# Altium schematic sheet power.SchDoc
size B; SheetNumber: 3; SheetTotal: 6
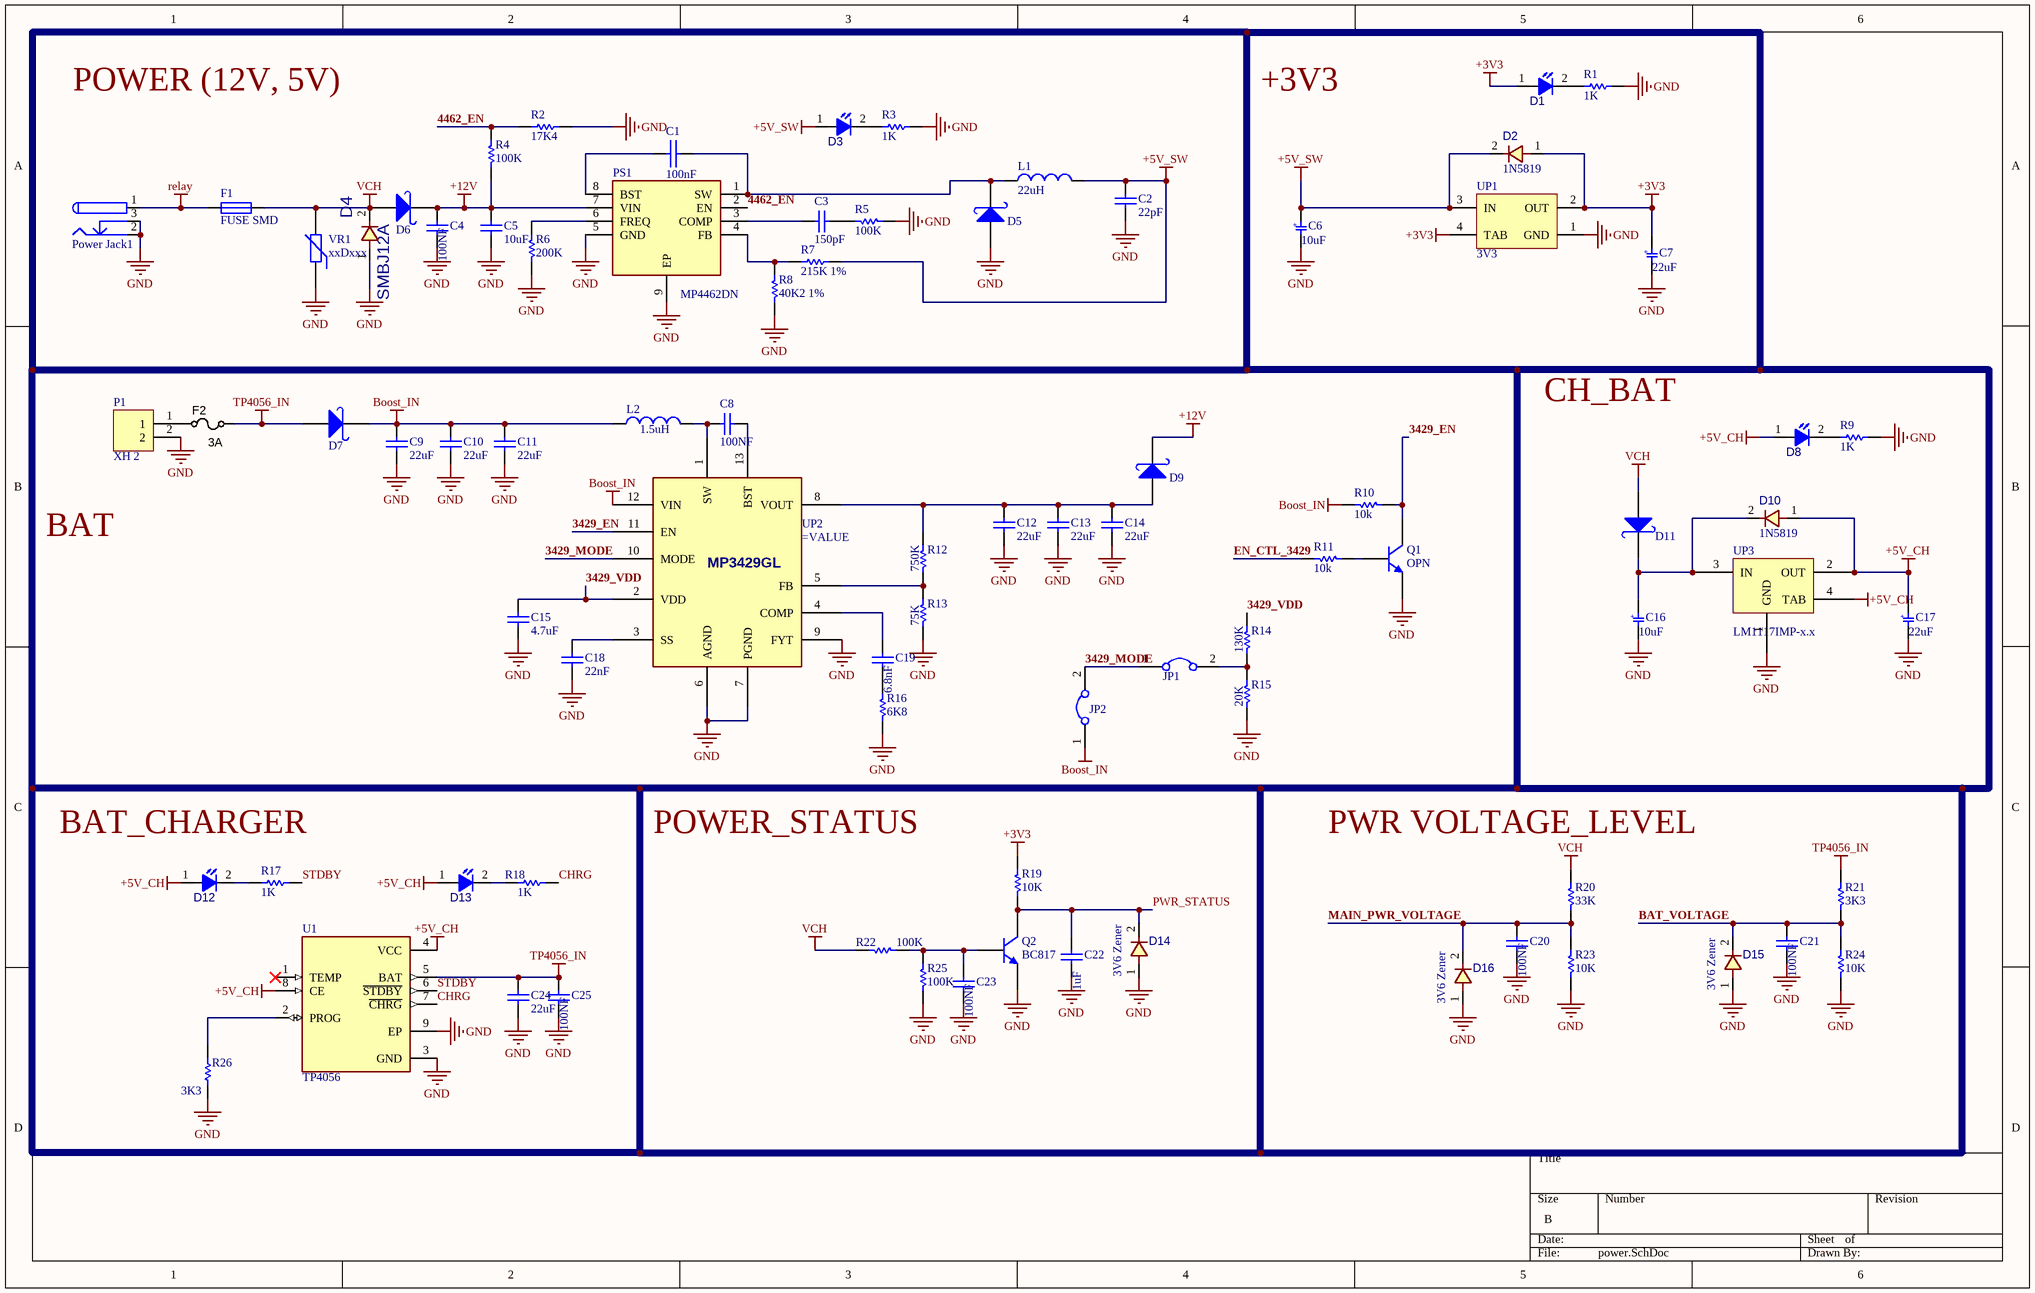
[diagram p0: power.SchDoc]

## Parts
C1  100nF  [Cap-0805]
C2  22pF  [CAPC4817X12N]
C3  150pF  [CAPC3413X12N]
C4  100NF  [CAP0603]
C5  10uF  [CAPC4817X12N]
C6  10uF  [Cap_A]
C7  22uF  [Cap_A]
C8  100NF  [CAP0603]
C9  22uF  [Cap1206_(3216X15L)]
C10  22uF  [Cap1206_(3216X15L)]
C11  22uF  [Cap1206_(3216X15L)]
C12  22uF  [Cap1206_(3216X15L)]
C13  22uF  [Cap1206_(3216X15L)]
C14  22uF  [Cap1206_(3216X15L)]
C15  4.7uF  [CAPC3413X12N]
C16  10uF  [Cap_A]
C17  22uF  [Cap_A]
C18  22nF  [CAPC3413X12N]
C19  6.8nF  [CAP0603]
C20  100NF  [CAP0603]
C21  100NF  [CAP0603]
C22  1uF  [CAP0603]
C23  100NF  [CAP0603]
C24  22uF  [Cap1206_(3216X15L)]
C25  100NF  [CAP0603]
D1  RED LED  [LED SMD 0805 (Red)]  (value not drawn)
D2  value 1N5819  [D_SMA]  (hidden comment: 1n5819 SMD SS31)
D3  RED LED  [LED SMD 0805 (Red)]  (value not drawn)
D4  value SMBJ12A  [D_SMB]  (hidden comment: SMBJ12A-TR SMD)
D5  1n5822  [DIOM7568X24N]  (value not drawn)
D6  1n5822  [DIOM7568X24N]  (value not drawn)
D7  1n5822  [DIOM7568X24N]  (value not drawn)
D8  RED LED  [LED SMD 0805 (Red)]  (value not drawn)
D9  1n5822  [DIOM7568X24N]  (value not drawn)
D10  value 1N5819  [D_SMA]  (hidden comment: 1n5819 SMD SS31)
D11  1n5822  [DIOM7568X24N]  (value not drawn)
D12  RED LED  [LED SMD 0805 (Red)]  (value not drawn)
D13  GREEN LED  [LED SMD 0805 (Green)]  (value not drawn)
D14  value 3V6 Zener  [D_SOD80]  (hidden comment: 5Z1)
D15  value 3V6 Zener  [D_SOD80]  (hidden comment: 5Z1)
D16  value 3V6 Zener  [D_SOD80]  (hidden comment: 5Z1)
F1  FUSE SMD  [8-1206]
F2  3A  [RESC1608X55N]
JP1  Jumper  [Jumper Small - 2.54 - GRAY]  (value not drawn)
JP2  Jumper  [Jumper Small - 2.54 - GRAY]  (value not drawn)
L1  22uH  [INDUCTOR_SMD_3A]
L2  1.5uH  [INDUCTOR_SMD_3A]
P1  XH 2  [XH 2 PIN ( White )]
Power_Jack1  Power Jack.  [Power Jack.]  (value not drawn)
PS1  MP4462DN  [SOIC127P600X170-9N]
Q1  OPN  [SOT23_N]
Q2  BC817  [SOT23_N]
R1  1K  [R0603]
R2  17K4  [SMD-0805-RES]
R3  1K  [R0603]
R4  100K  [R0603]
R5  100K  [R0603]
R6  200K  [R0603]
R7  215K 1%  [SMD-0805-RES]
R8  value 40K2 1%  [R0603]  (hidden comment: 40K2)
R9  1K  [R0603]
R10  10k  [R0603]
R11  10k  [R0603]
R12  750K  [R0603]
R13  75K  [R0603]
R14  130K  [R0603]
R15  20K  [R0603]
R16  value 6K8  [R0603]  (hidden comment: 100K)
R17  1K  [R0603]
R18  1K  [R0603]
R19  10K  [R0603]
R20  33K  [R0603]
R21  3K3  [R0603]
R22  100K  [R0603]
R23  10K  [R0603]
R24  10K  [R0603]
R25  100K  [R0603]
R26  3K3  [R0603]
U1  TP4056  [SOP127P600X175-9N]
UP1  3V3  [SOT223]
UP2  (no value)  [GFN-13 (3mm*4mm)]
UP3  LM1117IMP-x.x  [SOT223_4]
VR1  xxDxxx  [05D XXX]

## Nets
+3V3: C7.2 D1.1(ANODE) D2.1 R19.1 UP1.2(OUT) UP1.4(TAB)
+5V_CH: C17.2 D8.1(ANODE) D10.1 D12.1(ANODE) D13.1(ANODE) U1.4(VCC) U1.8(CE) UP3.2(OUT) UP3.4(TAB)
+5V_SW: C2.2 C6.2 D2.2 D3.1(ANODE) L1.2 R7.2 UP1.3(IN)
+12V: C4.2 C5.2 D6.2(K) D9.2(K) PS1.7(VIN) R4.1
Boost_IN: C9.2 C10.2 C11.2 D7.2(K) JP2.1 L2.1 R10.1 UP2.12(VIN)
GND: C2.1 C4.1 C5.1 C6.1 C7.1 C9.1 C10.1 C11.1 C12.1 C13.1 C14.1 C15.1 C16.1 C17.1 C18.1 C20.1 C21.1 C22.1 C23.1 C24.1 C25.1 D4.1 D5.1(A) D14.1 D15.1 D16.1 P1.2 Power_Jack1.2 Power_Jack1.3 PS1.5(GND) PS1.9(EP) Q1.2(E) Q2.2(E) R1.2 R2.2 R3.2 R5.2 R6.2 R8.1 R9.2 R13.1 R15.1 R16.2 R23.2 R24.2 R25.2 R26.1 U1.3(GND) U1.9(EP) UP1.1(GND) UP2.6(AGND) UP2.7(PGND) UP2.9(FYT) UP3.1(GND) VR1.1
relay: F1.1 Power_Jack1.1
TP4056_IN: C24.2 C25.2 D7.1(A) F2.2 R21.1 U1.5(BAT)
VCH: D4.2 D6.1(A) D11.1(A) F1.2 R20.1 R22.2 VR1.2
3429_EN: Q1.3(C) R10.2 UP2.11(EN)
3429_MODE: JP1.1 JP2.2 UP2.10(MODE)
3429_VDD: C15.2 R14.2 UP2.2(VDD)
4462_EN: PS1.2(EN) R2.1 R4.2
BAT_VOLTAGE: C21.2 D15.2 R21.2 R24.1
CHRG: R18.2 U1.7(~{CHRG})
EN_CTL_3429: R11.2
MAIN_PWR_VOLTAGE: C20.2 D16.2 R20.2 R23.1
PWR_STATUS: C22.2 D14.2 Q2.3(C) R19.2
STDBY: R17.2 U1.6(~{STDBY})
NetC1_1: C1.1 PS1.8(BST)
NetC1_2: C1.2 D5.2(K) L1.1 PS1.1(SW)
NetC3_1: C3.1 PS1.3(COMP)
NetC3_2: C3.2 R5.1
NetC8_1: C8.1 L2.2 UP2.1(SW)
NetC8_2: C8.2 UP2.13(BST)
NetC12_2: C12.2 C13.2 C14.2 D9.1(A) R12.2 UP2.8(VOUT)
NetC16_2: C16.2 D10.2 D11.2(K) UP3.3(IN)
NetC18_2: C18.2 UP2.3(SS)
NetC19_1: C19.1 R16.1
NetC19_2: C19.2 UP2.4(COMP)
NetC23_2: C23.2 Q2.1(B) R22.1 R25.1
NetD1_2: D1.2(CATHODE) R1.1
NetD3_2: D3.2(CATHODE) R3.1
NetD8_2: D8.2(CATHODE) R9.1
NetD12_2: D12.2(CATHODE) R17.1
NetD13_2: D13.2(CATHODE) R18.1
NetF2_1: F2.1 P1.1
NetJP1_2: JP1.2 R14.1 R15.2
NetPS1_4: PS1.4(FB) R7.1 R8.2
NetPS1_6: PS1.6(FREQ) R6.1
NetQ1_1: Q1.1(B) R11.1
NetR12_1: R12.1 R13.2 UP2.5(FB)
NetR26_2: R26.2 U1.2(PROG)

Not connected (* = marked no-connect by the designer): U1 1(TEMP)*

## Notes on the sheet
- POWER (12V, 5V)
- +3V3
- CH_BAT
- BAT
- BAT_CHARGER
- POWER_STATUS
- (near R20) PWR VOLTAGE_LEVEL
- (in symbol Capacitor Tantalum SMD) +
- (in symbol MP3429) MP3429GL

## Library data of the parts
C1 = Capacitor.: Capacitor; LatestRevisionDate: 17-Jul-2002; LatestRevisionNote: Re-released for DXP Platform.; Publisher: Altium Limited; Value: 100nF
C2 C5 = CAP SMD 1206: CAP 1206; Designer: Abbas Basereh; Desc.: CAP SMD 1206; Data: 16-12-2016
C3 C15 C18 = CAP SMD 0805: CAP 0805; Designer: Abbas Basereh; Desc.: CAP SMD 0805; Data: 16-12-2016
C4 C8 C20 C21 C23 C25 = CAP SMD PACKAGE: TOTAL CAPACITOR SMD PACK; Designer: Abbas Basereh; Desc.: CAP SMD TOTAL PACKAGES; Data: 2017-3-10; VALUE: 100nF
C6 C7 C16 C17 = Capacitor Tantalum SMD: DatasheetVersion: 2021; ComponentLink1Description: Website Smart World; ComponentLink1URL: https://www.smartw.ir/; ComponentLink2Description: Telegram; ComponentLink2URL: https://t.me/altium_smartw; ComponentLink3Description: Instagram; ComponentLink3URL: https://Instagram.com/smartgw.ir
C9-C14 C19 C22 C24 = CAP SMD PACKAGE: TOTAL CAPACITOR SMD PACK; Designer: Abbas Basereh; Desc.: CAP SMD TOTAL PACKAGES; VALUE: 100nF; Data: 2017-3-10
D1 D3 D8 D12 D13 = LED SMD 0805: ComponentLink1Description: Website Smart World; ComponentLink1URL: https://www.smartw.ir/; ComponentLink2Description: Telegram; ComponentLink2URL: https://t.me/altium_smartw; ComponentLink3Description: Instagram; ComponentLink3URL: https://Instagram.com/smartgw.ir; DatasheetVersion: 2021
D2 D10 = 1N4007 SMD M7: DIODE, GENERAL PURPOSE, 1000V/1A; DatasheetVersion: 2021; ComponentLink1Description: Website Smart World; ComponentLink1URL: https://www.smartw.ir/; ComponentLink2Description: Telegram; ComponentLink2URL: https://t.me/altium_smartw; ComponentLink3Description: Instagram; ComponentLink3URL: https://Instagram.com/smartgw.ir
D4 = SMBJ12A-TR SMD: TVS Surface Mount Transient Voltage Suppressors Diode; ComponentLink1Description: Tarahiboard; ComponentLink1URL: https://www.tarahiboard.com/product/library-pack; DatasheetVersion: 2022
D5-D7 D9 D11 = 1n5822 SMD: Schottky Rectifiers; Part. No: SS34; Manufacturer: ON Semiconductor/Fairchild; Designer: Abbas Basereh; Link: https://www.aliexpress.com/item/Free-shipping-100pcs-1n5822-sma-smd-do-214ac-Schottky-diode-ss34/32337482329.html?spm=2114.01010208.3.1.zLZDsP&ws_ab_test=searchweb0_0,searchweb201602_4_10065_10068_10084_10083_10080_10082_10081_10060_10061_10062_10056_10055_10054_10059_10099_10078_10079_427_10073_10103_10102_10096_10052_10050_10051,searchweb201603_4&btsid=6e50dc92-ac69-45bc-a19e-209af19ce602; Link: http://www.tme.eu/en/details/ss34/smd-schottky-diodes/vishay/ss34-e357t/; Link: http://www.digikey.com/product-detail/en/on-semiconductor-fairchild/SS34/SS34FSCT-ND/2094459; Data: 16-12-2016
D14-D16 = 1N4148 SMD: DIODE, FAST SWTICHING, 0.3A, 0.5W
F1 = FUSE SMD: SMD FUSE
F2 = FUSE_160mA_0603: Fuse 3A 63VDC 0603 SMD; Manufacturer 1: Holly Fuse; Manufacturer Part Number 1: 06T-0160L; Ratings: 160mA; 63VDC; slow-blow; SCDType: spec; Package / Case: 0603 (1608 metric)
JP1 JP2 = Jumper: Company: E.P.I.L; Defualt State: Close; Design Date: 2011/11/02
L1 L2 = INDUCTOR_SMD_3A
P1 = Conector XH 2 Pin: ComponentLink1Description: Tarahiboard; ComponentLink1URL: https://www.tarahiboard.com/product/library-pack; DatasheetVersion: 2022
PS1 = MP4560DN-LF: Power Supply; Manufacturer_Name: Monolithic Power Systems (MPS); Datasheet Link: http://uk.rs-online.com/web/p/products/9175759; Height: 1.7mm; Manufacturer_Part_Number: MP4462DN; Mouser Part Number: MP4462DN; Mouser Price/Stock: https://www.mouser.com/Search/Refine.aspx?Keyword=946-MP4560DNLF
Q1 Q2 = C945: NPN Silicon Epitaxial Planar Transistor; Published: 2017-2-8; LatestRevisionDate: 2017; LatestRevisionNote: IPC-7351 Footprint Added.; DatasheetVersion: 2017; PackageVersion: 2017-2-8; PackageReference: SOT23; Publisher: Abbas Basereh; PackageDescription: 3-Pin SOT-23 Package 0.95 mm Pitch, 2.3 mm Lead Span; ComponentLink1Description: Manufacturer Link; ComponentLink1URL: http://www.taitroncomponents.com/; ComponentLink2Description: Datasheet; ComponentLink2URL: http://www.taitroncomponents.com/
R1 R3-R6 R8-R26 = Resistor SMD 0603
  R1 R3 R9 R17 R18: Value: 1K
  R4 R5: DatasheetVersion: 2021; Value: 100K
  R6: DatasheetVersion: 2021; Value: 200K
  R8 R12-R16: DatasheetVersion: 2021
R2 R7 = Resistor SMD 0805: DatasheetVersion: 2021; ComponentLink1Description: Website Smart World; ComponentLink1URL: https://www.smartw.ir/; ComponentLink2Description: Telegram; ComponentLink2URL: https://t.me/altium_smartw; ComponentLink3Description: Instagram; ComponentLink3URL: https://Instagram.com/smartgw.ir
U1 = TP4056: Complete single cell Li-Ion battery with a constant current / constant voltage linear charger; MF: NanJing Top Power ASIC Corp.; Check_prices: https://www.snapeda.com/parts/TP4056/NanJing+Top+Power+ASIC+Corp./view-part/?ref=eda; SnapEDA_Link: https://www.snapeda.com/parts/TP4056/NanJing+Top+Power+ASIC+Corp./view-part/?ref=snap; Price: None; Availability: Not in stock; Package: Package; MP: TP4056; Value: *
UP1 = AMS1117-x.x: x.x Volt, 800mA Low-Dropout Linear Regulator, 4-pin SOT-223; Designer: Ali Hafizi; Data: 16-12-2016
UP2 = MP3429: 16VOUT, 21A, High-Efficiency,  Fully Integrated, Synchronous,  Boost Converter
UP3 = LM1117IMP-x.x: x.x Volt, 800mA Low-Dropout Linear Regulator, 4-pin SOT-223; Designer: Abbas Basereh; Data: 16-12-2016; VALUE: LM1117IMP-x.x
VR1 = VARISTOR (VDR): VARISTORS; Manufacturer: china-canada-philipina; Designer: Abbas Basereh; Models: MOV-VDR-COV; Data: 2017-1-5; Link: digikey.com; VALUE: xxDxxx; PUBLISHER: ABBAS BASEREH